# Altium schematic sheet Main.SchDoc
size A4; Organization: Altium Limited; Address1: L3, 12a Rodborough Rd; Address2: Frenchs Forest; Address3: NSW; Address4: Australia 2086; DocumentNumber: 1; SheetNumber: 1; SheetTotal: 22
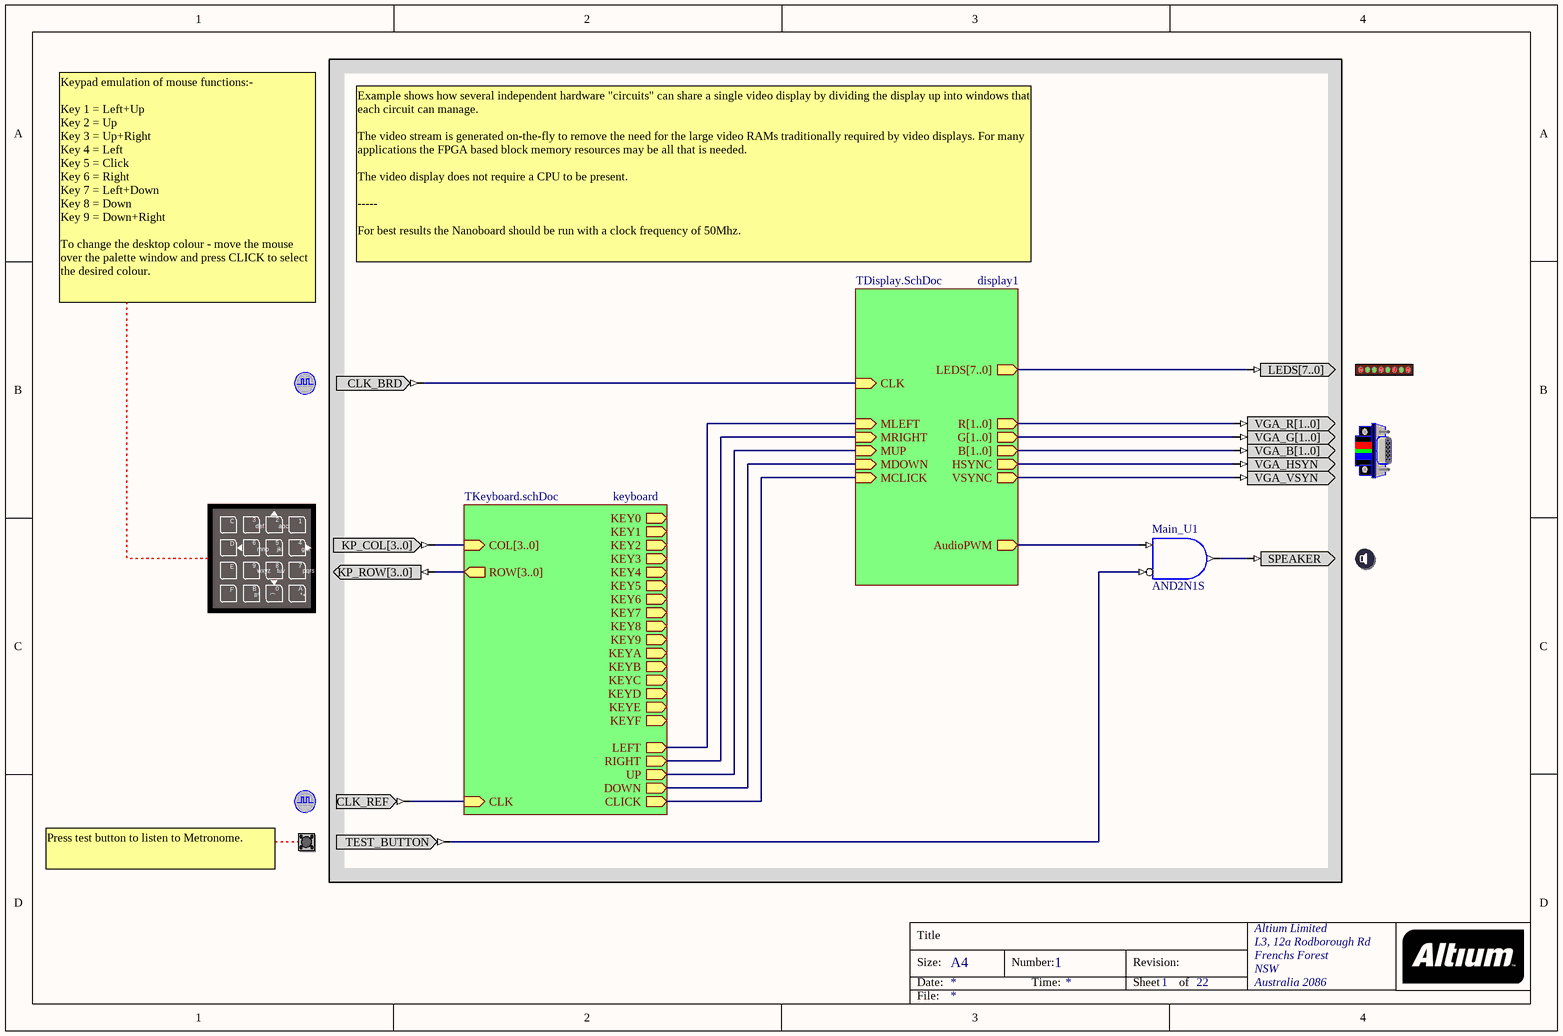
[diagram p0: Main.SchDoc]

## Parts
(Parts that share a designator on the sheet are numbered #1, #2 ... from top to bottom, then left to right.)
?#1  LED  (value not drawn)
?#2  CLOCK_BOARD  (value not drawn)
?#3  VGACNTR  (value not drawn)
?#4  KEYPAD  (value not drawn)
?#5  SPEAKER  (value not drawn)
?#6  CLOCK_REFERENCE  (value not drawn)
?#7  TEST_BUTTON  (value not drawn)
Main_U1  AND2N1S

## Sub-sheets
display1 = TDisplay.SchDoc: CLK (in), HSYNC (out), VSYNC (out), R[1..0] (out), G[1..0] (out), B[1..0] (out), MLEFT (in), MRIGHT (in), LEDS[7..0] (out), MUP (in), MDOWN (in), MCLICK (in), AudioPWM (out)
keyboard = TKeyboard.schDoc: CLK (in), ROW[3..0] (out), COL[3..0] (in), KEY1 (out), KEY4 (out), KEY7 (out), KEYA (out), KEY2 (out), KEY5 (out), KEY8 (out), KEY0 (out), KEY3 (out), KEY6 (out), KEY9 (out), KEYB (out), KEYC (out), KEYD (out), KEYE (out), KEYF (out), LEFT (out), RIGHT (out), UP (out), DOWN (out), CLICK (out)

## Nets
Net?#1_LEDS[7..0]: ?#1.LEDS[7..0] ; sheet display1/LEDS[7..0]
Net?#2_CLK_BRD: ?#2.CLK_BRD ; sheet display1/CLK
Net?#3_VGA_B[1..0]: ?#3.VGA_B[1..0] ; sheet display1/B[1..0]
Net?#3_VGA_G[1..0]: ?#3.VGA_G[1..0] ; sheet display1/G[1..0]
Net?#3_VGA_HSYN: ?#3.VGA_HSYN ; sheet display1/HSYNC
Net?#3_VGA_R[1..0]: ?#3.VGA_R[1..0] ; sheet display1/R[1..0]
Net?#3_VGA_VSYN: ?#3.VGA_VSYN ; sheet display1/VSYNC
Net?#4_KP_COL[3..0]: ?#4.KP_COL[3..0] ; sheet keyboard/COL[3..0]
Net?#4_KP_ROW[3..0]: ?#4.KP_ROW[3..0] ; sheet keyboard/ROW[3..0]
Net?#5_SPEAKER: ?#5.SPEAKER Main_U1.O
Net?#6_CLK_REF: ?#6.CLK_REF ; sheet keyboard/CLK
Net?#7_TEST_BUTTON: ?#7.TEST_BUTTON Main_U1.I0
NetMain_U1_I1: Main_U1.I1 ; sheet display1/AudioPWM
(unnamed): sheet display1/MLEFT, sheet keyboard/LEFT
(unnamed): sheet display1/MRIGHT, sheet keyboard/RIGHT
(unnamed): sheet display1/MUP, sheet keyboard/UP
(unnamed): sheet display1/MDOWN, sheet keyboard/DOWN
(unnamed): sheet display1/MCLICK, sheet keyboard/CLICK

## Notes on the sheet
- Keypad emulation of mouse functions:-
  Key 1 = Left+Up
  Key 2 = Up
  Key 3 = Up+Right
  Key 4 = Left
  Key 5 = Click
  Key 6 = Right
  Key 7 = Left+Down
  Key 8 = Down
  Key 9 = Down+Right
  To change the desktop colour - move the mouse over the palette window and press CLICK to select the desired colour.
- Example shows how several independent hardware "circuits" can share a single video display by dividing the display up into windows that each circuit can manage.
  The video stream is generated on-the-fly to remove the need for the large video RAMs traditionally required by video displays. For many applications the FPGA based block memory resources may be all that is needed.
  The video display does not require a CPU to be present.
  -----
  For best results the Nanoboard should be run with a clock frequency of 50Mhz.
- Press test button to listen to Metronome.
- Title
- Size:
- Date:
- A4
- Number:
- Time:
- Revision:
- Sheet
- of
- File:
- (in symbol KEYPAD) C; 3; 2; 1; def; abc; 6; 5; 4; D; mno; jkl; ghi; E; 9; 8; 7; wxyz; tuv; pqrs; F; B; 0; A; #^; (; *+

## Library data of the parts
?#1 = LED: 8-Way LEDS; PortComponent: True; Published: 19-Nov-2003; Publisher: Altium Limited
?#2 = CLOCK_BOARD: Global System Clock Supply; PortComponent: True; Published: 19-Nov-2003; Publisher: Altium Limited
?#3 = VGACNTR: VGA Dsub-15-Female-HD; PortComponent: True; Published: 19-Nov-2003; Publisher: Altium Limited
?#4 = KEYPAD: Key Pad; PortComponent: True; Published: 19-Nov-2003; Publisher: Altium Limited
?#5 = SPEAKER: Sound interface; PortComponent: True; Published: 19-Nov-2003; Publisher: Altium Limited
?#6 = CLOCK_REFERENCE: Global System Clock Reference Supply; PortComponent: True; Published: 19-Nov-2003; Publisher: Altium Limited
?#7 = TEST_BUTTON: Test Button; PortComponent: True; Published: 19-Nov-2003; Publisher: Altium Limited
Main_U1 = AND2N1S: 2-Input AND Gate with Active Low A Input, Single Pin Version; Xilinx Equivalent: AND2B1; ArchiveName: GENERIC; Published: 18-Dec-2003; Publisher: Altium Limited; Core Revision: 1.00.00